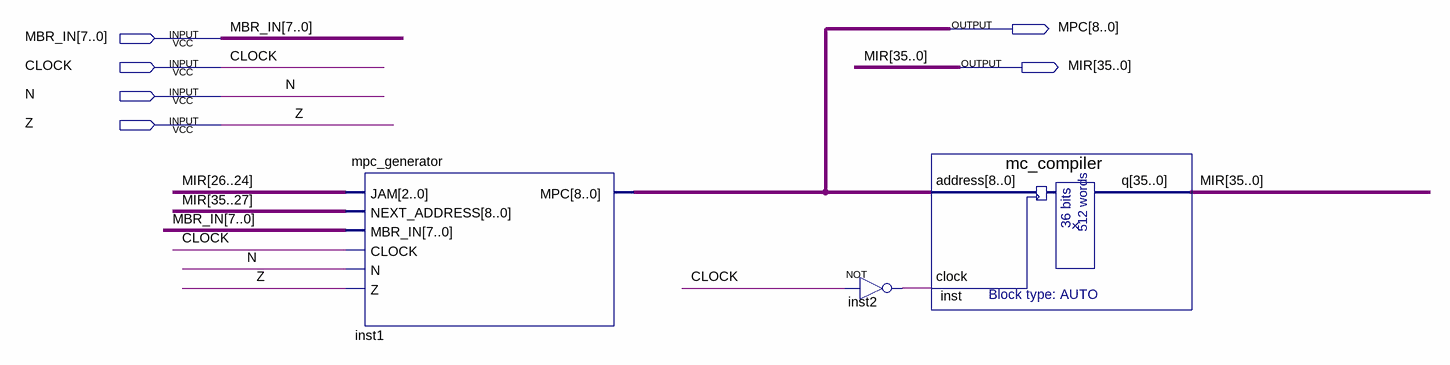
[diagram p0: schematic sheet]
// Quartus schematic CONTROL_UNITY.bdf as structural Verilog: 3 symbols, 6 pins
module CONTROL_UNITY (
  input  [7:0] MBR_IN,
  input  CLOCK,
  input  N,
  input  Z,
  output [8:0] MPC,
  output [35:0] MIR
);

  wire inst2_out;

  mpc_generator inst1 (
    .JAM(MIR[26:24]), .NEXT_ADDRESS(MIR[35:27]), .MBR_IN(MBR_IN), .CLOCK(CLOCK), .N(N), .Z(Z), .MPC(MPC));
  not inst2 (inst2_out, CLOCK);
  mc_compiler inst (.address(MPC), .clock(inst2_out), .q(MIR));
endmodule
